# Altium schematic sheet POWER.SchDoc
size A4
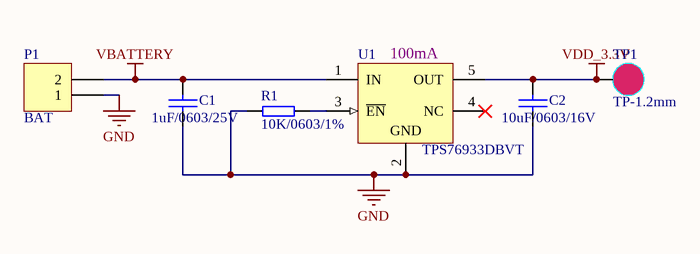
[diagram p0: POWER.SchDoc]

## Parts
C1  1uF/0603/25V  [0603]
C2  10uF/0603/16V  [0603]
P1  BAT  [白色连接器2.54]
R1  10K/0603/1%  [0603]
TP1  TP-1.2mm  [TP-1.2mm]
U1  TPS76933DBVT  [TI-DBV5_N]

## Nets
GND: C1.2 C2.2 P1.1 R1.1 U1.2(GND)
VBATTERY: C1.1 P1.2 U1.1(IN)
VDD_3.3V: C2.1 TP1.1 U1.5(OUT)
NetR1_2: R1.2 U1.3(~{EN})

Not connected (* = marked no-connect by the designer): U1 4(NC)*

## Notes on the sheet
- (near U1) 100mA

## Library data of the parts
C1 C2 = CAP: Capacitor
P1 = Header 2: Header, 2-Pin; LatestRevisionDate: 17-Jul-2002; LatestRevisionNote: Re-released for DXP Platform.; Publisher: Altium Limited
R1 = RES
U1 = TPS76933DBVT: Single Output LDO, 100 mA, Fixed 3.3 V Output, 2.7 to 10 V Input, with Low IQ, 5-pin SOT-23 (DBV), -40 to 125 degC, Green (RoHS & no Sb/Br); Manufacturer: Texas Instruments; Accuracy(%): 3; Fixed Output Options(V): 3.3; Iout(Max)(A): 0.1; Iq(Typ)(mA): 0.02; Rating: Catalog; SubFamily: Single Channel LDO; Vdo(Typ)(mV): 98; Vin(Max)(V): 10; Vin(Min)(V): 2.7; DatasheetVersion: SLVS203E; PackageVersion: 4073253-4/K; PackageReference: DBV5; PackageDescription: 5-Pin Plastic Small Outline, Body 1.60 脳 2.90 mm, Pitch 0.95 mm; Supplier 1: Digi-Key; Supplier Part Number 1: 296-2760-2-ND; Supplier 2: Digi-Key; Supplier Part Number 2: 296-2760-1-ND; Supplier 3: Digi-Key; Supplier Part Number 3: 296-2760-6-ND; Supplier 4: Farnell; Supplier Part Number 4: 8461538; Supplier 5: Farnell; Supplier Part Number 5: 8461538RL; Supplier 6: Newark; Supplier Part Number 6: 77C1165; Supplier 7: Mouser; Supplier Part Number 7: 595-TPS76933DBVT; Eco-Plan: Green (RoHS & no Sb/Br); Vout Adj(Max)(V): 3.3; Vout Adj(Min)(V): 3.3; Mounting Technology: Surface Mount; Code_JEDEC: MO-178; PartNumber: TPS76933DBVT; ComponentLink1Description: Manufacturer URL; ComponentLink1URL: http://www.ti.com/; ComponentLink2Description: Datasheet; ComponentLink2URL: http://www.ti.com/general/docs/lit/getliterature.tsp?genericPartNumber=TPS76933&fileType=pdf; ComponentLink3Description: Package Specification; ComponentLink3URL: http://www.ti.com/litv/pdf/mpds018i; ComponentLink4Description: URL Link1; ComponentLink4URL: Samples URL:http://www.ti.com/product/tps76933#samples